# Altium schematic sheet sensor_matrix_03.SchDoc
size A; SheetNumber: 3; SheetTotal: 5
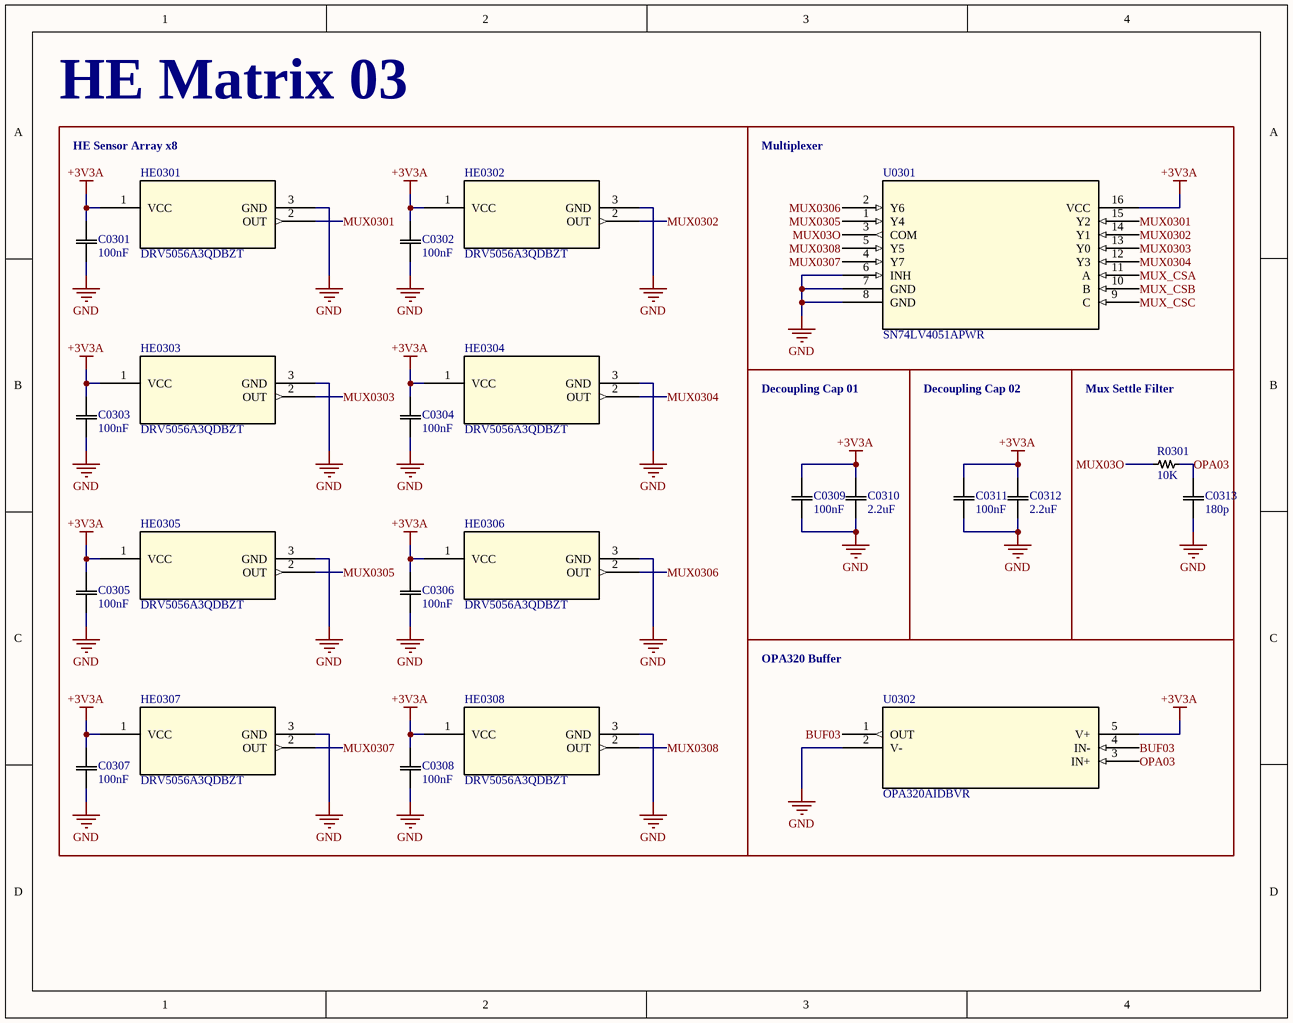
[diagram p0: sensor_matrix_03.SchDoc]

## Parts
C0301  100nF  [CAPC10555_55N_KEM]
C0302  100nF  [CAPC10555_55N_KEM]
C0303  100nF  [CAPC10555_55N_KEM]
C0304  100nF  [CAPC10555_55N_KEM]
C0305  100nF  [CAPC10555_55N_KEM]
C0306  100nF  [CAPC10555_55N_KEM]
C0307  100nF  [CAPC10555_55N_KEM]
C0308  100nF  [CAPC10555_55N_KEM]
C0309  100nF  [CAPC10555_55N_KEM]
C0310  2.2uF  [CAPC10555_55N_KEM]
C0311  100nF  [CAPC10555_55N_KEM]
C0312  2.2uF  [CAPC10555_55N_KEM]
C0313  180p  [CAPC10555_55N_KEM]
HE0301  DRV5056A3QDBZT  [DBZ3_TEX]
HE0302  DRV5056A3QDBZT  [DBZ3_TEX]
HE0303  DRV5056A3QDBZT  [DBZ3_TEX]
HE0304  DRV5056A3QDBZT  [DBZ3_TEX]
HE0305  DRV5056A3QDBZT  [DBZ3_TEX]
HE0306  DRV5056A3QDBZT  [DBZ3_TEX]
HE0307  DRV5056A3QDBZT  [DBZ3_TEX]
HE0308  DRV5056A3QDBZT  [DBZ3_TEX]
R0301  10K  [RES0402_CPF_TYCO_TYC]
U0301  SN74LV4051APWR  [PW16]
U0302  OPA320AIDBVR  [DBV5]

## Blocks framed on the sheet
HE Matrix 03: C0301 C0302 C0303 C0304 C0305 C0306 C0307 C0308 HE0301 HE0302 HE0303 HE0304 HE0305 HE0306 HE0307 HE0308
Multiplexer: U0301
OPA320 Buffer: U0302

## Nets
+3V3A: C0301.2 C0302.2 C0303.2 C0304.2 C0305.2 C0306.2 C0307.2 C0308.2 C0309.2 C0310.2 C0311.2 C0312.2 HE0301.1(VCC) HE0302.1(VCC) HE0303.1(VCC) HE0304.1(VCC) HE0305.1(VCC) HE0306.1(VCC) HE0307.1(VCC) HE0308.1(VCC) U0301.16(VCC) U0302.5(V+)
GND: C0301.1 C0302.1 C0303.1 C0304.1 C0305.1 C0306.1 C0307.1 C0308.1 C0309.1 C0310.1 C0311.1 C0312.1 C0313.1 HE0301.3(GND) HE0302.3(GND) HE0303.3(GND) HE0304.3(GND) HE0305.3(GND) HE0306.3(GND) HE0307.3(GND) HE0308.3(GND) U0301.6(INH) U0301.7(GND) U0301.8(GND) U0302.2(V-)
BUF03: U0302.1(OUT) U0302.4(IN-)
MUX03O: R0301.2 U0301.3(COM)
MUX0301: HE0301.2(OUT) U0301.15(Y2)
MUX0302: HE0302.2(OUT) U0301.14(Y1)
MUX0303: HE0303.2(OUT) U0301.13(Y0)
MUX0304: HE0304.2(OUT) U0301.12(Y3)
MUX0305: HE0305.2(OUT) U0301.1(Y4)
MUX0306: HE0306.2(OUT) U0301.2(Y6)
MUX0307: HE0307.2(OUT) U0301.4(Y7)
MUX0308: HE0308.2(OUT) U0301.5(Y5)
MUX_CSA: U0301.11(A)
MUX_CSB: U0301.10(B)
MUX_CSC: U0301.9(C)
OPA03: C0313.2 R0301.1 U0302.3(IN+)

## Notes on the sheet
- HE Sensor Array x8
- Decoupling Cap 01
- Decoupling Cap 02
- Mux Settle Filter

## Library data of the parts
C0301 C0302 C0303 C0304 C0305 C0306 C0307 C0308 C0309 C0310 C0311 C0312 C0313 = C0402: SMD Comm X7R, Ceramic, SMD, MLCC, Temperature Stable, 0402; Manufacturer_Name: Kemet; Manufacturer_Part_Number: C0402C104K4RACTU; Copyright: Copyright (C) 2025 Ultra Librarian. All rights reserved.; Datasheet: https://content.kemet.com/datasheets/KEM_C1002_X7R_SMD.pdf
HE0301 HE0302 HE0303 HE0304 HE0305 HE0306 HE0307 HE0308 = DRV5056A3QDBZT: Ratiometric unipolar linear hall effect sensor with analog output 3-SOT-23 -40 to 125; Manufacturer_Name: Texas Instruments; Copyright: Copyright (C) 2025 Ultra Librarian. All rights reserved.; Manufacturer_Part_Number: DRV5056A3QDBZT; Datasheet: https://www.ti.com/lit/gpn/drv5056; RefDes: RefDes; Type: Type
R0301 = R0402: CPF 0402 RL; Manufacturer_Name: TE Connectivity; Manufacturer_Part_Number: CPF0402B33RE1; Copyright: Copyright (C) 2025 Ultra Librarian. All rights reserved.; Datasheet: https://www.te.com/commerce/DocumentDelivery/DDEController?Action=srchrtrv&DocNm=1773200&DocType=Data+Sheet&DocLang=English&PartCntxt=1-1879208-3&DocFormat=pdf
U0301 = SN74LV4051APWR: 5V 8:1 one-channel general-purpose analog multiplexer 16-TSSOP -40 to 85; Manufacturer_Name: Texas Instruments; Copyright: Copyright (C) 2025 Ultra Librarian. All rights reserved.; Manufacturer_Part_Number: SN74LV4051APWR; Datasheet: https://www.ti.com/lit/gpn/sn74lv4051a; RefDes: RefDes; Type: Type
U0302 = OPA320AIDBVR: Precision, zero-crossover, 20-MHz, 0.9-pA Ib, RRIO, CMOS operational amplifier 5-SOT-23 -40 to 125; Manufacturer_Name: Texas Instruments; Copyright: Copyright (C) 2025 Ultra Librarian. All rights reserved.; Manufacturer_Part_Number: OPA320AIDBVR; Datasheet: https://www.ti.com/lit/gpn/opa320; RefDes: RefDes; Type: Type